# EAGLE design untitled (EAGLE 9.6.2)
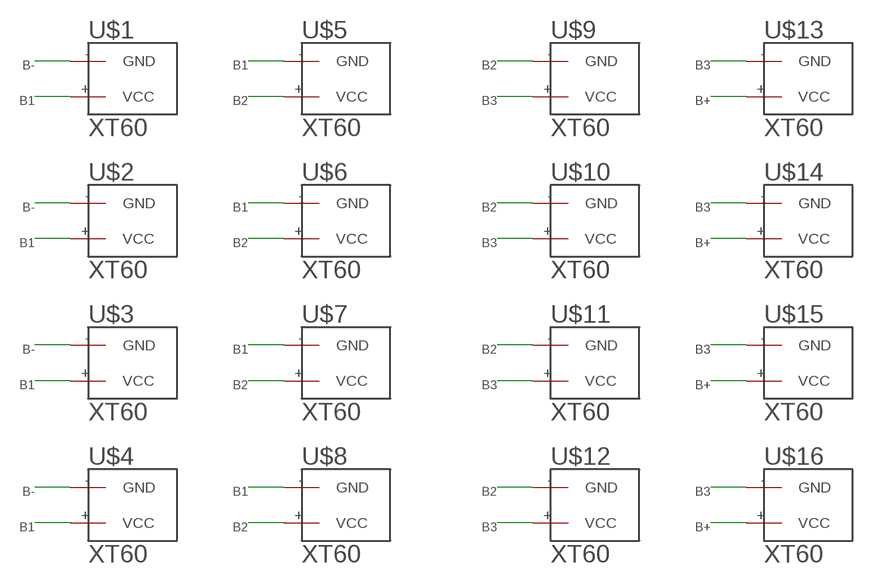
[diagram p0: schematic, sheet 1]

## Parts
U$1  XT60  [XT60]
U$2  XT60  [XT60]
U$3  XT60  [XT60]
U$4  XT60  [XT60]
U$5  XT60  [XT60]
U$6  XT60  [XT60]
U$7  XT60  [XT60]
U$8  XT60  [XT60]
U$9  XT60  [XT60]
U$10  XT60  [XT60]
U$11  XT60  [XT60]
U$12  XT60  [XT60]
U$13  XT60  [XT60]
U$14  XT60  [XT60]
U$15  XT60  [XT60]
U$16  XT60  [XT60]

## Nets
B1: U$1.+(VCC) U$2.+(VCC) U$3.+(VCC) U$4.+(VCC) U$5.-(GND) U$6.-(GND) U$7.-(GND) U$8.-(GND)
B2: U$5.+(VCC) U$6.+(VCC) U$7.+(VCC) U$8.+(VCC) U$9.-(GND) U$10.-(GND) U$11.-(GND) U$12.-(GND)
B3: U$9.+(VCC) U$10.+(VCC) U$11.+(VCC) U$12.+(VCC) U$13.-(GND) U$14.-(GND) U$15.-(GND) U$16.-(GND)
B+: U$13.+(VCC) U$14.+(VCC) U$15.+(VCC) U$16.+(VCC)
B-: U$1.-(GND) U$2.-(GND) U$3.-(GND) U$4.-(GND)

## Library data of the parts
U$1-U$16 = XT60:XT60: XT60

## Board
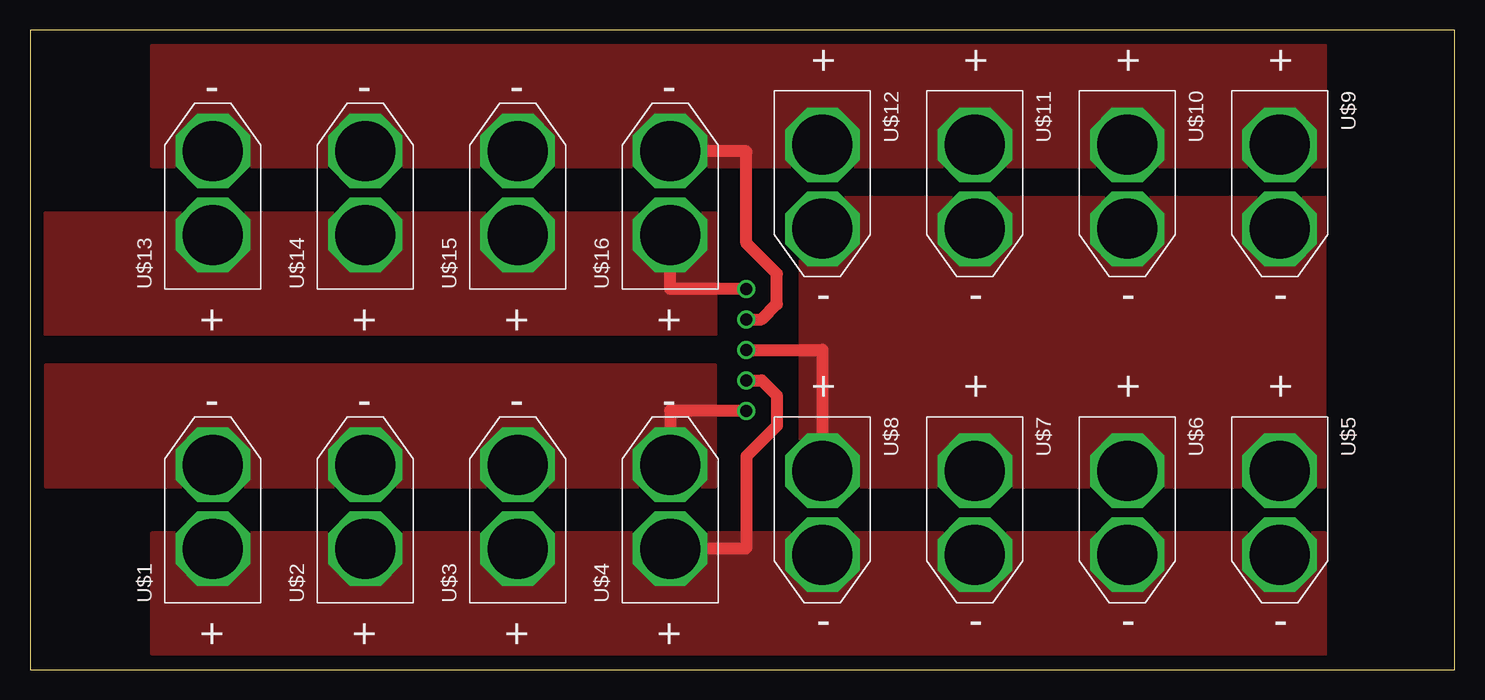
[diagram p1: board, top side]

Size 118.75 x 53.34 mm. Coordinates in mm from the lower left corner, seen from the top.
Outline: 0,0 118.75,0 118.75,53.34 0,53.34 0,0
Copper layers (1*16): Top 0.035mm / dielectric 1.5mm / Bottom 0.035mm
Design rules "default *": minimum track width 6mil, minimum drill 0.35mm, track to track 6mil, track to pad 6mil, pad to pad 6mil, via to via 6mil, smd to smd 6mil, copper to edge 40mil, drill to drill 6mil, minimum pad ring 10mil, minimum via ring 8mil, stop-mask expansion 4mil, vias tented up to drill 0mil, thermal gap 0mil

### Footprints (pad centres in the part's own frame; a part is rotated, then mirrored left to right if it is on the bottom)
XT60 = drill 5 pad 6.2 octagon: + 4.5,0; - 11.5,0

### Placement (x,y rotation side)
U$1  15.24,5.59 90 top
U$2  27.94,5.59 90 top
U$3  40.64,5.59 90 top
U$4  53.34,5.59 90 top
U$5  104.14,21.08 270 top
U$6  91.44,21.08 270 top
U$7  78.74,21.08 270 top
U$8  66.04,21.08 270 top
U$9  104.14,48.26 270 top
U$10  91.44,48.26 270 top
U$11  78.74,48.26 270 top
U$12  66.04,48.26 270 top
U$13  15.24,31.75 90 top
U$14  27.94,31.75 90 top
U$15  40.64,31.75 90 top
U$16  53.34,31.75 90 top

### Tracks (layer width: path | path; a pad name or v marks a point on that pad's centre or on a via)
B1  (via drill 1)
  Top 1.016: v59.69,24.13 60.96,24.13 62.23,22.86 62.23,20.32 59.69,17.78 59.69,10.16 59.62,10.09 U$4.+
  pour Top: 10.16,1.27 10.16,11.43 107.95,11.43 107.95,1.27
B2  (via drill 1)
  Top 1.016: v59.69,26.67 66.04,26.67 U$8.+
  pour Top: 64.14,15.24 107.95,15.24 107.95,39.37 64.14,39.37
B3  (via drill 1)
  Top 1.016: v59.69,29.21 60.96,29.21 62.23,30.48 62.23,33.02 59.69,35.56 59.69,43.18 59.62,43.25 U$16.-
  pour Top: 107.95,41.91 10.16,41.91 10.16,52.07 107.95,52.07
B+  (via drill 1)
  Top 1.016: v59.69,31.75 53.34,31.75 U$16.+
  pour Top: 1.27,38.1 57.15,38.1 57.15,27.94 1.27,27.94
B-  (via drill 1)
  Top 1.016: v59.69,21.59 53.34,21.59 U$4.-
  pour Top: 57.15,15.24 57.15,25.4 1.27,25.4 1.27,15.24